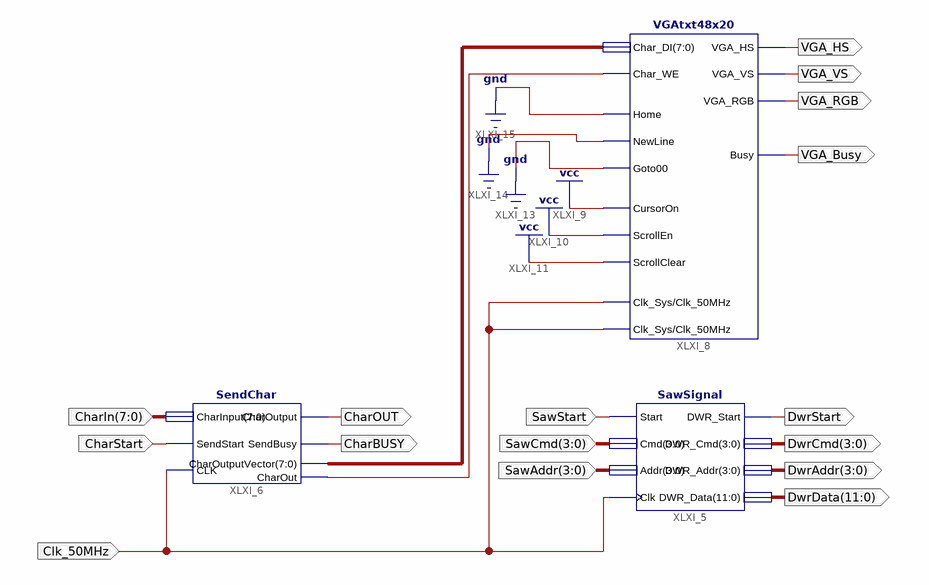
[diagram p0: schematic sheet 1]
// Xilinx ISE schematic schemOne.sch (spartan3e) as structural Verilog: 3 symbols, 16 ports
module schemOne (
  input  SawStart,
  input  [3:0] SawCmd,
  input  [3:0] SawAddr,
  input  Clk_50MHz,
  input  CharStart,
  input  [7:0] CharIn,
  output [11:0] DwrData,
  output [3:0] DwrAddr,
  output [3:0] DwrCmd,
  output DwrStart,
  output CharBUSY,
  output CharOUT,
  output VGA_HS,
  output VGA_VS,
  output VGA_RGB,
  output VGA_Busy
);

  wire XLXN_3;
  wire [7:0] XLXN_2;

  SawSignal XLXI_5 (
    .Clk(Clk_50MHz), .Start(SawStart), .Addr(SawAddr), .Cmd(SawCmd), .DWR_Start(DwrStart),
    .DWR_Addr(DwrAddr), .DWR_Cmd(DwrCmd), .DWR_Data(DwrData));
  SendChar XLXI_6 (
    .CharInput(CharIn), .SendStart(CharStart), .CLK(Clk_50MHz), .CharOutput(CharOUT), .SendBusy(CharBUSY),
    .CharOutputVector(XLXN_2), .CharOut(XLXN_3));
  VGAtxt48x20 XLXI_8 (
    .Char_DI(XLXN_2), .Home(1'b0), .NewLine(1'b0), .Goto00(1'b0), .Clk_Sys(Clk_50MHz), .Clk_50MHz(Clk_50MHz),
    .CursorOn(1'b1), .ScrollEn(1'b1), .ScrollClear(1'b1), .Busy(VGA_Busy), .VGA_HS(VGA_HS), .VGA_VS(VGA_VS),
    .VGA_RGB(VGA_RGB), .Char_WE(XLXN_3));
endmodule
